# EAGLE design pecoskiSmartWatch-BASIC-TOP (EAGLE 9.6.2)
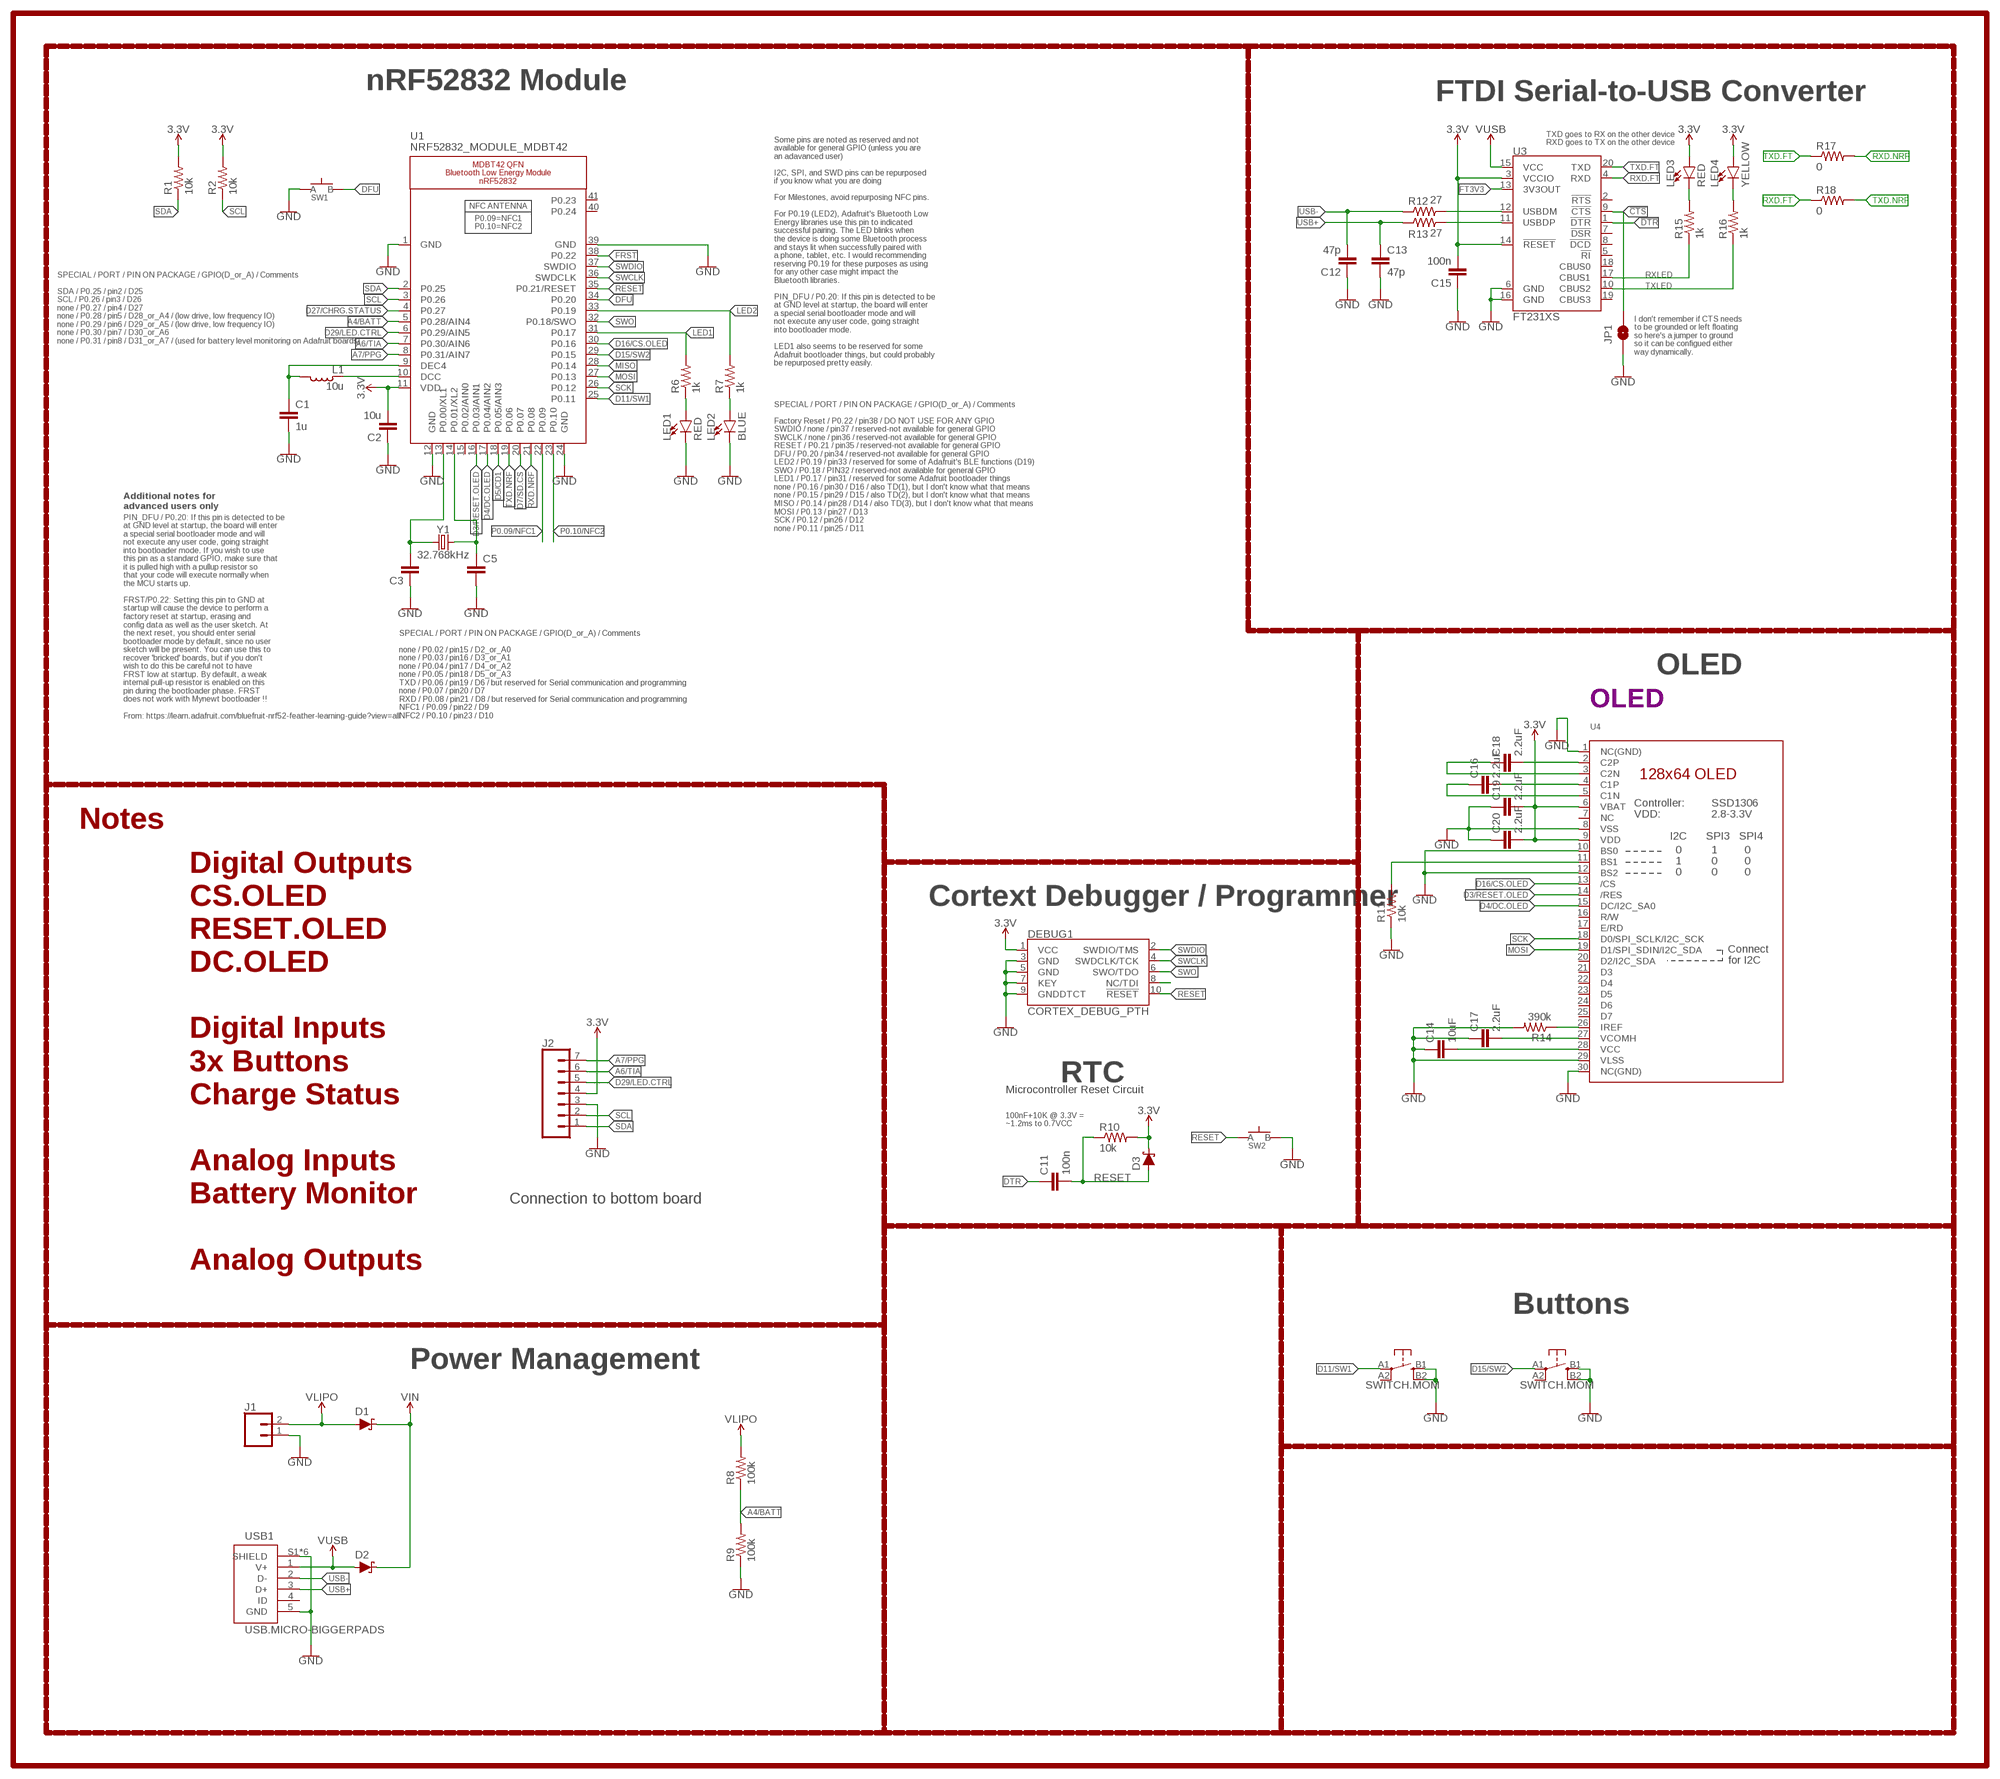
[diagram p0: schematic, sheet 1]

## Parts
C1  1u  CAPACITOR0603  [C0603]
C2  10u  CAPACITOR0805  [C0805]
C3  CAPACITOR0603  [C0603]
C5  CAPACITOR0603  [C0603]
C11  100n  CAPACITOR0603  [C0603]
C12  47p  CAPACITOR0603  [C0603]
C13  47p  CAPACITOR0603  [C0603]
C14  10uF  CAPACITOR0603  [C0603]
C15  100n  CAPACITOR0603  [C0603]
C16  2.2uF  CAPACITOR0402  [C0402]
C17  2.2uF  CAPACITOR0402  [C0402]
C18  2.2uF  CAPACITOR0402  [C0402]
C19  2.2uF  CAPACITOR0402  [C0402]
C20  2.2uF  CAPACITOR0402  [C0402]
D1  SCHOTTKY-USC  [USC]
D2  SCHOTTKY-USC  [USC]
D3  SCHOTTKY-USC  [USC]
DEBUG1  CORTEX_DEBUG_PTH  [2X5-PTH-1.27MM]
J1  CONN_02  [1X02]
J2  CONN_07-1.27MM  [1X07_1.27MM]
JP1  JUMPER-SMT_2_NO_SILK  [SMT-JUMPER_2_NO_SILK]
L1  10u  INDUCTOR0603  [L0603]
LED1  RED  LED0603  [LED-0603]
LED2  BLUE  LED0603  [LED-0603]
LED3  RED  LED0603  [LED-0603]
LED4  YELLOW  LED0603  [LED-0603]
R1  10k  RESISTOR0603  [R0603]
R2  10k  RESISTOR0603  [R0603]
R6  1k  RESISTOR0603  [R0603]
R7  1k  RESISTOR0603  [R0603]
R8  100k  RESISTOR0603  [R0603]
R9  100k  RESISTOR0603  [R0603]
R10  10k  RESISTOR0603  [R0603]
R11  10k  RESISTOR0603  [R0603]
R12  27  RESISTOR0603  [R0603]
R13  27  RESISTOR0603  [R0603]
R14  390k  RESISTOR0603  [R0603]
R15  1k  RESISTOR0603  [R0603]
R16  1k  RESISTOR0603  [R0603]
R17  0  RESISTOR0603  [R0603]
R18  0  RESISTOR0603  [R0603]
SW1  SPST-PTS830GG140-COPY.1-3  [BUTTON-GULLWING]
SW2  SPST-PTS830GG140-COPY.1-3  [BUTTON-GULLWING]
SW3  SWITCH.MOM  [TACTILE_SWITCH_SMD_6.2MM_TALL]
SW4  SWITCH.MOM  [TACTILE_SWITCH_SMD_6.2MM_TALL]
U1  NRF52832_MODULE_MDBT42  [BLE_MODULE_RAYTAC_MDBT42]
U3  FT231XS  [SSOP20_L]
U4  DISP_OLED_UG-2864HSWEG01-NO-WRAPAROUND  [UG-2864HSWEG01_0.96IN_NO-WRAPAROUND]
USB1  USB.MICRO-BIGGERPADS  [USB-MICRO-01.BIGGERPADS]
Y1  32.768kHz  CRYSTALECS-.327-12.5-12-C-TR  [2-SMD.NOLEAD.2.0MMTO1.2MM]

## Nets
3.3V: C2.2 C15.2 C19.2 C20.2 D3.-(C) DEBUG1.1(VCC) J2.4 LED3.A LED4.A R1.2 R2.2 R10.2 U1.11(VDD) U3.3(VCCIO) U3.14(!RESET) U4.6(VBAT) U4.9(VDD)
!CTS: JP1.2 U3.9(!CTS)
!DTR: U3.1(!DTR)
A4/BATT: R8.1 R9.2 U1.5(P0.28/AIN4)
A6/TIA: J2.6 U1.7(P0.30/AIN6)
A7/PPG: J2.7 U1.8(P0.31/AIN7)
D3/RESET.OLED: U1.16(P0.03/AIN1) U4.14(/RES)
D4/DC.OLED: U1.17(P0.04/AIN2) U4.15(DC/I2C_SA0)
D5/CD1: U1.18(P0.05/AIN3)
D7/SD.CS: U1.20(P0.07)
D11/SW1: SW3.A1 U1.25(P0.11)
D15/SW2: SW4.A1 U1.29(P0.15)
D16/CS.OLED: U1.30(P0.16) U4.13(/CS)
D27/CHRG.STATUS: U1.4(P0.27)
D29/LED.CTRL: J2.5 U1.6(P0.29/AIN5)
DFU: SW1.3(B) U1.34(P0.20)
DTR: C11.1
FRST: U1.38(P0.22)
FT3V3: U3.13(3V3OUT)
GND: C1.2 C2.1 C3.1 C5.2 C12.1 C13.2 C14.1 C15.1 C17.1 C19.1 C20.1 DEBUG1.3(GND) DEBUG1.5(GND) DEBUG1.7(KEY) DEBUG1.9(GNDDTCT) J1.1 J2.3 JP1.1 LED1.C LED2.C R9.1 R11.1 R14.2 SW1.1(A) SW2.3(B) SW3.B1 SW3.B2 SW4.B1 SW4.B2 U1.1(GND) U1.12(GND) U1.24(GND) U1.39(GND) U3.6(GND) U3.16(GND) U4.1(NC(GND)) U4.8(VSS) U4.10(BS0) U4.12(BS2) U4.29(VLSS) U4.30(NC(GND)) USB1.5(GND) USB1.S1(SHIELD) USB1.S2(SHIELD) USB1.S3(SHIELD) USB1.S4(SHIELD) USB1.S5(SHIELD) USB1.S6(SHIELD)
LED1: R6.2 U1.31(P0.17)
LED2: R7.2 U1.33(P0.19)
MISO: U1.28(P0.14)
MOSI: U1.27(P0.13) U4.19(D1/SPI_SDIN/I2C_SDA)
N$1: R11.2 U4.11(BS1)
N$2: R14.1 U4.26(IREF)
N$3: C18.2 U4.2(C2P)
N$4: C3.2 U1.13(P0.00/XL1) Y1.P$1
N$5: C18.1 U4.3(C2N)
N$6: C5.1 U1.14(P0.01/XL2) Y1.P$2
N$7: C16.2 U4.4(C1P)
N$8: C16.1 U4.5(C1N)
N$9: LED1.A R6.1
N$10: LED2.A R7.1
N$11: L1.1 U1.10(DCC)
N$12: C1.1 L1.2 U1.9(DEC4)
N$13: C14.2 U4.28(VCC)
N$14: DEBUG1.8(NC/TDI)
N$15: C17.2 U4.27(VCOMH)
N$23: R12.2 U3.12(USBDM)
N$24: R13.2 U3.11(USBDP)
N$25: LED3.C R15.2
N$26: LED4.C R16.2
P0.09/NFC1: U1.22(P0.09)
P0.10/NFC2: U1.23(P0.10)
RESET: C11.2 D3.+(A) DEBUG1.10(!RESET) R10.1 SW2.1(A) U1.35(P0.21/RESET)
RXD.FT: R18.1 U3.4(RXD)
RXD.NRF: R17.2 U1.21(P0.08)
RXLED: R15.1 U3.17(CBUS1)
SCK: U1.26(P0.12) U4.18(D0/SPI_SCLK/I2C_SCK)
SCL: J2.2 R2.1 U1.3(P0.26)
SDA: J2.1 R1.1 U1.2(P0.25)
SWCLK: DEBUG1.4(SWDCLK/TCK) U1.36(SWDCLK)
SWDIO: DEBUG1.2(SWDIO/TMS) U1.37(SWDIO)
SWO: DEBUG1.6(SWO/TDO) U1.32(P0.18/SWO)
TXD.FT: R17.1 U3.20(TXD)
TXD.NRF: R18.2 U1.19(P0.06)
TXLED: R16.1 U3.10(CBUS2)
USB+: C13.1 R13.1 USB1.3(D+)
USB-: C12.2 R12.1 USB1.2(D-)
V_USB: D2.+(A) U3.15(VCC) USB1.1(V+) ; supply symbol labelled VUSB
VIN: D1.-(C) D2.-(C)
VLIPO: D1.+(A) J1.2 R8.2
Unconnected: SW3.A2 SW4.A2 U1.15(P0.02/AIN0) U1.40(P0.24) U1.41(P0.23) U3.2(!RTS) U3.5(!RI) U3.7(!DSR) U3.8(!DCD) U3.18(CBUS0) U3.19(CBUS3) U4.7(NC) U4.16(R/W) U4.17(E/RD) U4.20(D2/I2C_SDA) U4.21(D3) U4.22(D4) U4.23(D5) U4.24(D6) U4.25(D7) USB1.4(ID)

## Notes on the sheet
- nRF52832 Module
- FTDI Serial-to-USB Converter
- TXD goes to RX on the other device
  RXD goes to TX on the other device
- SPECIAL / PORT / PIN ON PACKAGE / GPIO(D_or_A) / Comments
  
  SDA / P0.25 / pin2 / D25
  SCL / P0.26 / pin3 / D26
  none / P0.27 / pin4 / D27
  none / P0.28 / pin5 / D28_or_A4 / (low drive, low frequency IO)
  none / P0.29 / pin6 / D29_or_A5 / (low drive, low frequency IO)
  none / P0.30 / pin7 / D30_or_A6
  none / P0.31 / pin8 / D31_or_A7 / (used for battery level monitoring on Adafruit boards)
- I don't remember if CTS needs
  to be grounded or left floating
  so here's a jumper to ground
  so it can be configued either
  way dynamically.
- Some pins are noted as reserved and not
  available for general GPIO (unless you are
  an adavanced user)
  
  I2C, SPI, and SWD pins can be repurposed
  if you know what you are doing
  
  For Milestones, avoid repurposing NFC pins.
  
  For P0.19 (LED2), Adafruit's Bluetooth Low
  Energy libraries use this pin to indicated
  successful pairing. The LED blinks when
  the device is doing some Bluetooth process
  and stays lit when successfully paired with
  a phone, tablet, etc. I would recommending
  reserving P0.19 for these purposes as using
  for any other case might impact the
  Bluetooth libraries.
  
  PIN_DFU / P0.20: If this pin is detected to be
  at GND level at startup, the board will enter
  a special serial bootloader mode and will
  not execute any user code, going straight
  into bootloader mode.
  
  LED1 also seems to be reserved for some
  Adafruit bootloader things, but could probably
  be repurposed pretty easily.
- Additional notes for
  advanced users only
- SPECIAL / PORT / PIN ON PACKAGE / GPIO(D_or_A) / Comments
  
  Factory Reset / P0.22 / pin38 / DO NOT USE FOR ANY GPIO
  SWDIO / none / pin37 / reserved-not available for general GPIO
  SWCLK / none / pin36 / reserved-not available for general GPIO
  RESET / P0.21 / pin35 / reserved-not available for general GPIO
  DFU / P0.20 / pin34 / reserved-not available for general GPIO
  LED2 / P0.19 / pin33 / reserved for some of Adafruit's BLE functions (D19)
  SWO / P0.18 / PIN32 / reserved-not available for general GPIO
  LED1 / P0.17 / pin31 / reserved for some Adafruit bootloader things
  none / P0.16 / pin30 / D16 / also TD(1), but I don't know what that means
  none / P0.15 / pin29 / D15 / also TD(2), but I don't know what that means
  MISO / P0.14 / pin28 / D14 / also TD(3), but I don't know what that means
  MOSI / P0.13 / pin27 / D13
  SCK / P0.12 / pin26 / D12
  none / P0.11 / pin25 / D11
- OLED
- OLED
- PIN_DFU / P0.20: If this pin is detected to be
  at GND level at startup, the board will enter
  a special serial bootloader mode and will
  not execute any user code, going straight
  into bootloader mode. If you wish to use
  this pin as a standard GPIO, make sure that
  it is pulled high with a pullup resistor so
  that your code will execute normally when
  the MCU starts up.
  
  FRST/P0.22: Setting this pin to GND at
  startup will cause the device to perform a
  factory reset at startup, erasing and
  config data as well as the user sketch. At
  the next reset, you should enter serial
  bootloader mode by default, since no user
  sketch will be present. You can use this to
  recover 'bricked' boards, but if you don't
  wish to do this be careful not to have
  FRST low at startup. By default, a weak
  internal pull-up resistor is enabled on this
  pin during the bootloader phase. FRST
  does not work with Mynewt bootloader !!
  
  From: https://learn.adafruit.com/bluefruit-nrf52-feather-learning-guide?view=all
- SPECIAL / PORT / PIN ON PACKAGE / GPIO(D_or_A) / Comments
  
  none / P0.02 / pin15 / D2_or_A0
  none / P0.03 / pin16 / D3_or_A1
  none / P0.04 / pin17 / D4_or_A2
  none / P0.05 / pin18 / D5_or_A3
  TXD / P0.06 / pin19 / D6 / but reserved for Serial communication and programming
  none / P0.07 / pin20 / D7
  RXD / P0.08 / pin21 / D8 / but reserved for Serial communication and programming
  NFC1 / P0.09 / pin22 / D9
  NFC2 / P0.10 / pin23 / D10
- Notes
- Cortext Debugger / Programmer
- RTC
- Microcontroller Reset Circuit
- 100nF+10K @ 3.3V =
  ~1.2ms to 0.7VCC
- Connection to bottom board
- Digital Outputs
  CS.OLED
  RESET.OLED
  DC.OLED
  
  Digital Inputs
  3x Buttons
  Charge Status
  
  Analog Inputs
  Battery Monitor
  
  Analog Outputs
- Buttons
- Power Management

## Library data of the parts
C1-C3 C5 C11-C20 = LinnesLab-Passives:CAPACITOR
D1-D3 = LinnesLab-DiscreteSemi:SCHOTTKY: Schottky diode A Schottky diode is a semiconductor diode which has a low forward voltage drop and a very fast switching action. Example: Digi-Key Part Number: RB161MM-20CT-ND
DEBUG1 = LinnesLab-Connectors:CORTEX_DEBUG: Cortex Debug Connector - 10 pin Supports JTAG debug, Serial Wire debug, and Serial Wire Viewer. PTH and SMD connector options available. General Connector Information <http://infocenter.arm.com/help/topic/com.arm.doc.faqs/attached/13634/cortex_debug_connectors.pdf> Products: PTH Connector <http://www.digikey.com/product-detail/en/cnc-tech/3220-10-0100-00/1175-1627-ND/3883661> -via Digi-Key SparkFun PSoc <https://www.sparkfun.com/products/13229> SparkFun T <https://www.sparkfun.com/products/13810>
J1 = LinnesLab-Connectors:CONN_02: Multi connection point. Often used as Generic Header-pin footprint for 0.1 inch spaced/style header connections On any of the 0.1 inch spaced packages, you can populate with these: Break Away Headers - Straight <https://www.sparkfun.com/products/116> (PRT-00116) Break Away Male Headers - Right Angle <https://www.sparkfun.com/products/553> (PRT-00553) Female Headers <https://www.sparkfun.com/products/115> (PRT-00115) Break Away Headers - Machine Pin <https://www.sparkfun.com/products/117> (PRT-00117) Break Away Female Headers - Swiss Machine Pin <https://www.sparkfun.com/products/743> (PRT-00743) For SCREWTERMINALS and SPRING TERMINALS visit here: Screw Terimnals on SparkFun.com <https://www.sparkfun.com/search/results?term=Screw+Terminals> (5mm/3.5mm/2.54mm spacing) This device is also useful as a general connection point to wire up your design to another part of your project. Our various solder wires solder well into these plated through hole pads. Hook-Up Wire - Assortment (Stranded, 22 AWG) <https://www.sparkfun.com/products/11375> (PRT-11375) Hook-Up Wire - Assortment (Solid Core, 22 AWG) <https://www.sparkfun.com/products/11367> (PRT-11367) View the entire wire category on our website here <https://www.sparkfun.com/categories/141> Special notes: Molex polarized connector foot print use with: PRT-08233 with associated crimp pins and housings. 2.54_SCREWTERM for use with PRT-10571. 3.5mm Screw Terminal footprints for PRT-08084 5mm Screw Terminal footprints for use with PRT-08432
J2 = LinnesLab-Connectors:CONN_07: Multi connection point. Often used as Generic Header-pin footprint for 0.1 inch spaced/style header connections On any of the 0.1 inch spaced packages, you can populate with these: Break Away Headers - Straight <https://www.sparkfun.com/products/116> (PRT-00116) Break Away Male Headers - Right Angle <https://www.sparkfun.com/products/553> (PRT-00553) Female Headers <https://www.sparkfun.com/products/115> (PRT-00115) Break Away Headers - Machine Pin <https://www.sparkfun.com/products/117> (PRT-00117) Break Away Female Headers - Swiss Machine Pin <https://www.sparkfun.com/products/743> (PRT-00743) For SCREWTERMINALS and SPRING TERMINALS visit here: Screw Terimnals on SparkFun.com <https://www.sparkfun.com/search/results?term=Screw+Terminals> (5mm/3.5mm/2.54mm spacing) This device is also useful as a general connection point to wire up your design to another part of your project. Our various solder wires solder well into these plated through hole pads. Hook-Up Wire - Assortment (Stranded, 22 AWG) <https://www.sparkfun.com/products/11375> (PRT-11375) Hook-Up Wire - Assortment (Solid Core, 22 AWG) <https://www.sparkfun.com/products/11367> (PRT-11367) View the entire wire category on our website here <https://www.sparkfun.com/categories/141> Special notes: Molex polarized connector foot print use with SKU : PRT-08231 with associated crimp pins and housings. 1MM SMD Version SKU: PRT-10208 NOTES ON THE VARIANTS LOCK and LOCK_LONGPADS... This footprint was designed to help hold the alignment of a through-hole component (i.e. 6-pin header) while soldering it into place. You may notice that each hole has been shifted either up or down by 0.005 of an inch from it's more standard position (which is a perfectly straight line). This slight alteration caused the pins (the squares in the middle) to touch the edges of the holes. Because they are alternating, it causes a "brace" to hold the component in place. 0.005 has proven to be the perfect amount of "off-center" position when using our standard breakaway headers. Although looks a little odd when you look at the bare footprint, once you have a header in there, the alteration is very hard to notice. Also,if you push a header all the way into place, it is covered up entirely on the bottom side.
JP1 = LinnesLab-Switches:JUMPER-SMT_2_NO: Normally open jumper This jumper has two pads in close proximity to each other. Apply solder to close the connection. Round pads are easier to solder for beginners, but are a lot larger. SparkFun Product that uses the round pads: SparkFun EL Sequencer <https://www.sparkfun.com/products/12781>
L1 = LinnesLab-Passives:INDUCTOR
LED1-LED4 = LinnesLab-LED:LED: LED (Generic) Standard schematic elements and footprints for 5mm, 3mm, 1206, and 0603 sized LEDs. Generic LEDs with no color specified. LTST-C190KGKT: arrow indicates cathode
R1 R2 R6-R18 = LinnesLab-Passives:RESISTOR
SW1 SW2 = LinnesLab-Switches:SPST-PTS830GG140-COPY
SW3 SW4 = LinnesLab-Switches:SWITCH.MOM: PTS645SM43SMTR92 LFS
U1 = LinnesLab-Microcontrollers:NRF52832_MODULE_MDBT42: MDBT42 - BLE Module (nRF52832 QFN) VDD: 1.7-3.6V
U3 = LinnesLab-DigitalIC:FT231X: FTDI FT231X Full Speed USB to Full-handshake UART This USB2.0 Full Speed IC offers a compact bridge to full handshake UART interfaces. The device is a UART, capable of operating up to 3MBaud, with low power consumption (8mA). The FT231X includes the complete FT-X series feature set and enables USB to be added into a system design quickly and easily over a UART interface. Datasheet <http://cdn.sparkfun.com/datasheets/Components/General%20IC/DS_FT231X.pdf>; DIGIKEY: 768-1156-5-ND; MFN: FT231XS-U
U4 = LinnesLab-Displays:DISP_OLED_UG-2864HSWEG01: UG-2864HSWEG01 OLED display Both 1.3" and 0.96" models share the same FPC tab footprint, only the screen dimensions vary.
USB1 = LinnesLab-Connectors:USB.MICRO: DigiKey PN: 609-4613-1-ND
Y1 = LinnesLab-Clocks:CRYSTAL; DIGIKEY: XC2288CT-ND; FREQ: 32.7680KHZ; LOAD_CAP: 12.5pF

## Board
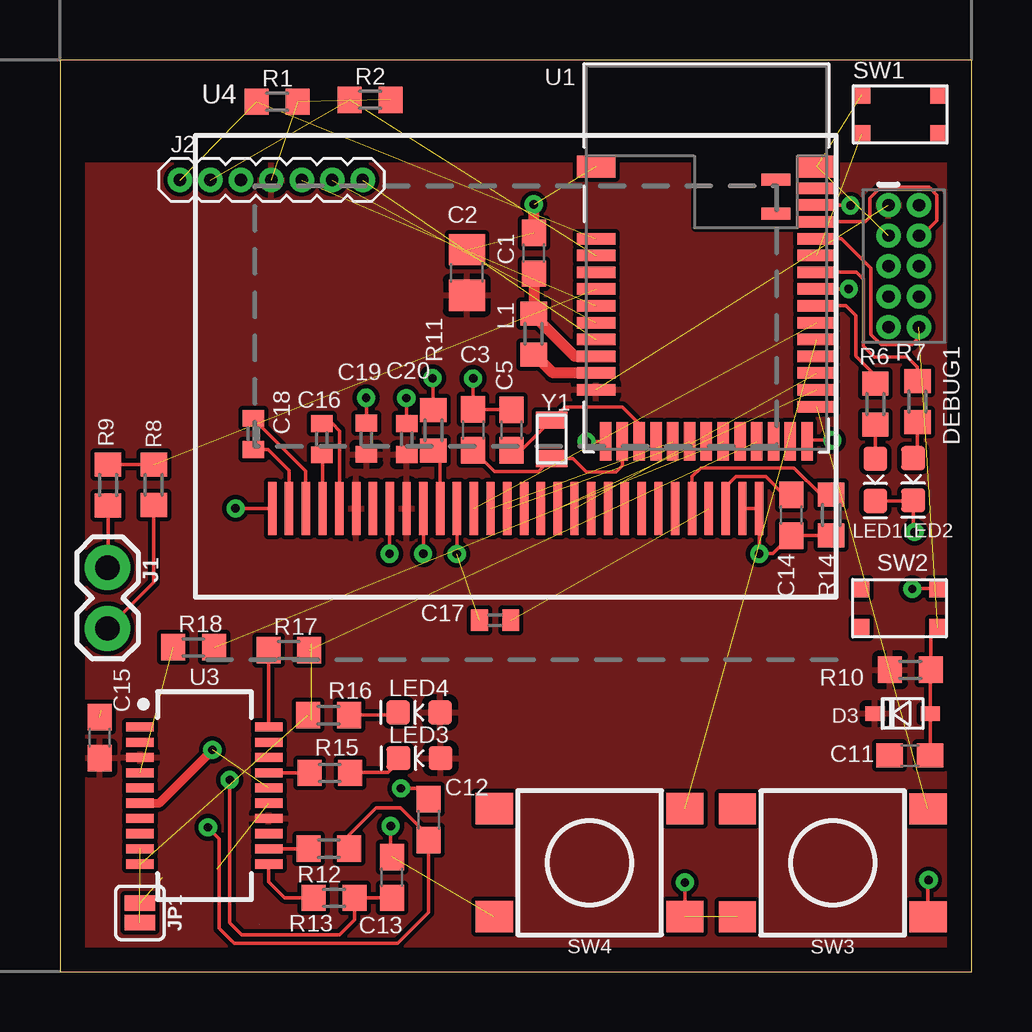
[diagram p1: board, top side]
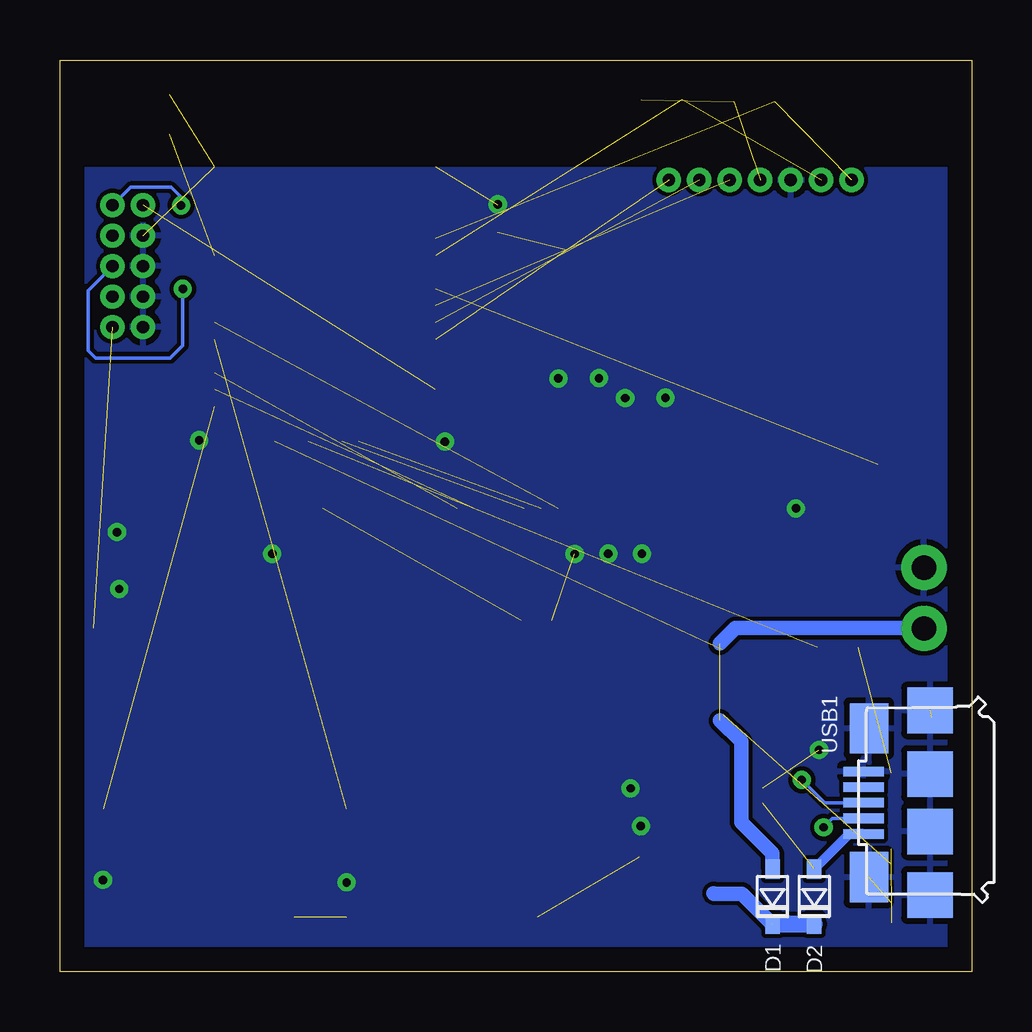
[diagram p2: board, bottom side, seen from below]

Size 38 x 38 mm. Coordinates in mm from the lower left corner, seen from the top.
Outline: 0,0 38,0 38,38 0,38 0,0
Copper layers (1*16): Top 0.035mm / dielectric 1.5mm / Bottom 0.035mm
Design rules "default": minimum track width 6mil, minimum drill 0.35mm, track to track 6mil, track to pad 6mil, pad to pad 6mil, via to via 6mil, smd to smd 6mil, copper to edge 40mil, drill to drill 6mil, minimum pad ring 10mil, minimum via ring 8mil, stop-mask expansion 4mil, vias tented up to drill 0mil, thermal gap 10mil

### Footprints (pad centres in the part's own frame; a part is rotated, then mirrored left to right if it is on the bottom)
C0603 = smd 1.1 x 1: 1 -0.85,0; 2 0.85,0
C0805 = smd 1.3 x 1.5: 1 -0.95,0; 2 0.95,0
C0402 = smd 0.7 x 0.9: 1 -0.65,0; 2 0.65,0
USC = smd 0.8 x 0.6: + -1.15,0; - 1.15,0
2X5-PTH-1.27MM = drill 0.508 pad 1: 1 -2.54,-0.635; 2 -2.54,0.635; 3 -1.27,-0.635; 4 -1.27,0.635; 5 0,-0.635; 6 0,0.635; 7 1.27,-0.635; 8 1.27,0.635; 9 2.54,-0.635; 10 2.54,0.635
1X02 = drill 1.016 pad 1.88: 1 0,0; 2 2.54,0
1X07_1.27MM = drill 0.508 pad 1: 1 0,0; 2 1.27,0; 3 2.54,0; 4 3.81,0; 5 5.08,0; 6 6.35,0; 7 7.62,0
SMT-JUMPER_2_NO_SILK = smd 0.635 x 1.27: 1 -0.406,0; 2 0.406,0
L0603 = smd 1 x 1.1: 1 -0.85,0; 2 0.85,0
LED-0603 = smd 1 x 1: A -0.877,0; C 0.877,0
R0603 = smd 1 x 1.1: 1 -0.85,0; 2 0.85,0
BUTTON-GULLWING = smd 0.7 x 0.75: 1 -1.6,0.825; 2 1.6,0.825; 3 -1.6,-0.825; 4 1.6,-0.825
TACTILE_SWITCH_SMD_6.2MM_TALL = smd 1.55 x 1.3: A1 -3.975,-2.25; A2 3.975,-2.25; B1 -3.975,2.25; B2 3.975,2.25
BLE_MODULE_RAYTAC_MDBT42 = smd 1.6 x 0.9: 1 -4.6,3.8; 39 4.6,3.8 | smd 1.6 x 0.48: 2 -4.6,0.8; 3 -4.6,0.1; 4 -4.6,-0.6; 5 -4.6,-1.3; 6 -4.6,-2; 7 -4.6,-2.7; 8 -4.6,-3.4; 9 -4.6,-4.1; 10 -4.6,-4.8; 11 -4.6,-5.5; 25 4.6,-6.2; 26 4.6,-5.5; 27 4.6,-4.8; 28 4.6,-4.1; 29 4.6,-3.4; 30 4.6,-2.7; 31 4.6,-2; 32 4.6,-1.3; 33 4.6,-0.6; 34 4.6,0.1; 35 4.6,0.8; 36 4.6,1.5; 37 4.6,2.2; 38 4.6,2.9 | smd 0.48 x 1.6: 12 -4.2,-7.65; 13 -3.5,-7.65; 14 -2.8,-7.65; 15 -2.1,-7.65; 16 -1.4,-7.65; 17 -0.7,-7.65; 18 0,-7.65; 19 0.7,-7.65; 20 1.4,-7.65; 21 2.1,-7.65; 22 2.8,-7.65; 23 3.5,-7.65; 24 4.2,-7.65 | smd 1.2 x 0.5: 40 2.9,3.25; 41 2.9,1.85
SSOP20_L = smd 0.381 x 1.143: 1 -2.857,-2.68; 2 -2.223,-2.68; 3 -1.587,-2.68; 4 -0.953,-2.68; 5 -0.318,-2.68; 6 0.318,-2.68; 7 0.953,-2.68; 8 1.587,-2.68; 9 2.223,-2.68; 10 2.857,-2.68; 11 2.857,2.68; 12 2.223,2.68; 13 1.587,2.68; 14 0.953,2.68; 15 0.318,2.68; 16 -0.318,2.68; 17 -0.953,2.68; 18 -1.587,2.68; 19 -2.223,2.68; 20 -2.857,2.68
UG-2864HSWEG01_0.96IN_NO-WRAPAROUND = smd 0.35 x 2.2: 1 -10.15,-1.2; 2 -9.45,-1.2; 3 -8.75,-1.2; 4 -8.05,-1.2; 5 -7.35,-1.2; 6 -6.65,-1.2; 7 -5.95,-1.2; 8 -5.25,-1.2; 9 -4.55,-1.2; 10 -3.85,-1.2; 11 -3.15,-1.2; 12 -2.45,-1.2; 13 -1.75,-1.2; 14 -1.05,-1.2; 15 -0.35,-1.2; 16 0.35,-1.2; 17 1.05,-1.2; 18 1.75,-1.2; 19 2.45,-1.2; 20 3.15,-1.2; 21 3.85,-1.2; 22 4.55,-1.2; 23 5.25,-1.2; 24 5.95,-1.2; 25 6.65,-1.2; 26 7.35,-1.2; 27 8.05,-1.2; 28 8.75,-1.2; 29 9.45,-1.2; 30 10.15,-1.2
USB-MICRO-01.BIGGERPADS = smd 0.4 x 1.7: 1 -1.3,1.505; 2 -0.65,1.505; 3 0,1.505; 4 0.65,1.505; 5 1.3,1.505 | smd 1.9 x 1.9: S1 -3.85,-1.27; S2 -1.2,-1.27; S3 1.2,-1.27; S4 3.85,-1.27 | smd 2.1 x 1.6: S5 -3.1,1.28; S6 3.1,1.28
2-SMD.NOLEAD.2.0MMTO1.2MM = smd 0.7 x 1.3: P$1 -0.8,0; P$2 0.8,0

### Placement (x,y rotation side)
C1  19.75,29.94 90 top
C2  16.96,29.14 270 top
C3  17.23,22.58 270 top
C5  18.83,22.57 90 top
C11  35.43,9 0 top
C12  15.36,6.33 270 top
C13  13.84,3.92 90 top
C14  30.48,19.02 90 top
C15  1.65,9.75 270 top
C16  10.92,22.19 270 top
C17  18.14,14.65 0 top
C18  8.06,22.42 270 top
C19  12.77,22.21 270 top
C20  14.46,22.2 270 top
D1  8.3,3.12 270 bottom
D2  6.56,3.12 270 bottom
D3  35.13,10.76 180 top
DEBUG1  35.17,29.41 270 top
J1  1.98,16.84 270 top
J2  5,33 0 top
JP1  3.33,2.44 270 top
L1  19.75,26.58 90 top
LED1  33.99,20.5 270 top
LED2  35.57,20.52 270 top
LED3  14.99,8.89 180 top
LED4  14.97,10.8 180 top
R1  9.06,36.26 0 top
R2  12.93,36.34 0 top
R6  33.99,23.65 90 top
R7  35.74,23.76 90 top
R8  3.91,20.29 270 top
R9  2,20.28 90 top
R10  35.45,12.58 180 top
R11  15.57,22.56 270 top
R12  11.21,5.13 180 top
R13  11.43,3.07 180 top
R14  32.15,19.03 270 top
R15  11.25,8.28 0 top
R16  11.2,10.69 0 top
R17  9.54,13.4 0 top
R18  5.57,13.51 0 top
SW1  35.03,35.73 0 top
SW2  35,15.15 180 top
SW3  32.21,4.53 180 top
SW4  22.08,4.54 180 top
U1  26.95,29.75 0 top
U3  6.02,7.34 270 top
U4  19,20.5 0 top
USB1  3,7.04 90 bottom
Y1  20.5,22.19 90 top

### Tracks (layer width: path | path; a pad name or v marks a point on that pad's centre or on a via)
3.3V  (3 unrouted)
  pour Top (isolate 0.178): 0.83,33.65 37.91,33.65 37.91,0.7 0.83,0.7
!CTS  (1 unrouted)
A4/BATT  (1 unrouted)
  Top 0.152: R8.1 3.9,21.13 R9.2
A6/TIA  (1 unrouted)
A7/PPG  (1 unrouted)
D3/RESET.OLED  (1 unrouted)
D4/DC.OLED  (1 unrouted)
D11/SW1  (1 unrouted)
D15/SW2  (1 unrouted)
D16/CS.OLED  (1 unrouted)
D29/LED.CTRL  (1 unrouted)
DFU  (1 unrouted)
GND  (via drill 0.35)  (10 unrouted)
  Top 0.152: U4.1 v7.33,19.3 v7.32,19.31 | C19.1 12.77,23.91 v12.76,23.92 | C20.1 14.45,22.86 14.45,23.89 v14.44,23.91 | v15.53,24.74 15.54,24.72 15.54,23.43 R11.1 | U4.29 U4.30 v29.15,17.42 | C13.2 13.79,4.82 v13.79,6.06 | C12.1 14.91,7.64 v14.22,7.64 | R9.1 2,16.86 J1.1 | v29.15,17.42 | U4.8 v13.75,17.43 v13.74,17.42 | U4.10 15.15,17.42 v15.14,17.41 | U4.12 v16.55,17.41 v16.54,17.41 | v17.22,24.72 v17.23,24.71 C3.1 C5.2 | U1.12 21.96,22.1 v21.95,22.09 | R14.2 32.14,18.18 C14.1 29.73,17.42 v29.15,17.42 | LED2.C 35.58,19.63 | SW2.3 35.56,15.97 v35.53,15.95 | LED1.C 35.54,19.62 LED2.C | v35.62,18.32 35.57,18.37 LED2.C | SW3.B1 36.19,3.79 v36.21,3.82 | SW4.B1 v26.05,3.71 | v26.05,3.71 | U1.24 31.19,22.15 v32.2,22.15
  Top 0.356: U3.6 4.13,7.02 v6.36,9.24
  Top 0.457: C1.2 v19.75,31.98
  pour Bottom (isolate 0.178): 0.68,33.48 37.87,33.48 37.87,0.74 0.7,0.74 0.7,33.4
LED1
  Top 0.152: U1.31 32.76,27.75 33.17,27.34 33.17,25.65 33.99,24.84 R6.2
LED2
  Top 0.152: U1.33 33.2,29.15 33.5,28.86 33.5,26.07 33.95,25.62 35.33,25.62 35.74,25.2 R7.2
MOSI  (1 unrouted)
N$1
  Top 0.152: R11.2 15.85,21.43 U4.11
N$2
  Top 0.152: R14.1 31.71,19.89 30.6,21 26.71,21 26.35,20.63 U4.26
N$3
  Top 0.152: C18.2 8.67,21.77 9.55,20.89 U4.2
N$4
  Top 0.152: C3.2 18.12,20.84 19.96,20.84 Y1.P$1 21.38,21.39 21.94,20.83 23.18,20.83 23.45,21.1 U1.13
N$5
  Top 0.152: C18.1 8.06,23.06 10.24,20.87 10.25,20.86 U4.3
N$6
  Top 0.152: U1.14 24.15,22.82 23.44,23.53 21.04,23.53 Y1.P$2 19.23,21.72 C5.1
N$7
  Top 0.152: C16.2 10.94,21.52 10.95,21.5 U4.4
N$8
  Top 0.152: U4.5 11.65,22.54 11.64,22.56 11.36,22.84 C16.1
N$9
  Top 0.152: R6.1 LED1.A
N$10
  Top 0.152: R7.1 35.74,21.57 LED2.A
N$11
  Top 0.457: U1.10 20.56,24.95 19.78,25.73 L1.1
N$12
  Top 0.457: U1.9 21.46,25.65 19.75,27.36 L1.2 C1.1
N$13
  Top 0.152: C14.2 30.17,19.88 29.42,20.63 28.18,20.63 27.75,20.2 U4.28
N$15  (1 unrouted)
  Top 0.152: U4.27 27.06,19.31
N$23
  Top 0.152: U3.12 10.34,5.11 R12.2
N$24
  Top 0.152: U3.11 8.7,3.74 9.37,3.07 R13.2
N$25
  Top 0.152: LED3.C 14.11,8.73 13.68,8.3 12.12,8.3 R15.2
N$26
  Top 0.152: R16.2 13.98,10.69 LED4.C
RESET  (1 unrouted)
  Top 0.152: C11.2 D3.+ 36.28,12.55 R10.1 36.3,14.03 SW2.1 | U1.35 32.58,30.54 33.8,29.32 33.8,26.56 34.23,26.13 35.52,26.13 35.81,26.42 DEBUG1.10
RXD.FT  (1 unrouted)
RXD.NRF  (1 unrouted)
RXLED
  Top 0.152: R15.1 U3.17
SCK  (1 unrouted)
SCL  (2 unrouted)
SDA  (2 unrouted)
SWCLK
  Top 0.152: U1.36 33.57,31.25 33.76,31.44 33.76,32.24 34.21,32.69 36.23,32.69 36.56,32.37 36.56,31.29 35.94,30.68 DEBUG1.4
SWDIO  (via drill 0.35)
  Top 0.152: 31.57,31.97 U1.37 32.94,31.95 v32.95,31.94
  Bottom 0.152: v32.95,31.94 32.95,32.27 33.37,32.69 35.06,32.69 DEBUG1.2
SWO  (via drill 0.35)
  Top 0.152: U1.32 v32.88,28.46
  Bottom 0.152: v32.88,28.46 32.88,26.1 33.4,25.58 36.52,25.58 36.82,25.88 36.82,28.39 DEBUG1.6
TXD.FT
  Top 0.152: U3.20 R17.1
TXD.NRF  (1 unrouted)
TXLED  (1 unrouted)
USB+  (via drill 0.35)
  Top 0.152: v7.08,7.99 7.08,2.03 7.57,1.53 11.65,1.53 12.28,2.16 R13.1 C13.1
  Bottom 0.152: USB1.3 6.12,7.04 v7.08,7.99
USB-  (via drill 0.35)
  Top 0.152: R12.1 12.06,5.71 13.17,6.83 14.19,6.83 15.36,5.66 C12.2 15.36,2.47 14.08,1.18 7.26,1.18 6.64,1.8 6.64,5.54 v6.17,6.01
  Bottom 0.152: USB1.2 5.8,6.39 v6.17,6.01
V_USB  (1 unrouted)
  Bottom 0.406: USB1.1 5.09,5.74 D2.+
VIN  (1 unrouted)
  Bottom 0.61: D1.- 9.57,3.25 10.73,3.25 10.75,3.27
  Bottom 0.711: D2.- D1.-
VLIPO  (1 unrouted)
  Top 0.152: R8.2 3.91,16.23 J1.2
  Bottom 0.61: J1.2 2,14.32 9.85,14.32 10.49,13.67 | D1.+ 8.3,4.92 9.6,6.23 9.6,9.59 10.48,10.47